# Altium schematic sheet Tranducer_Channel.SchDoc
size A
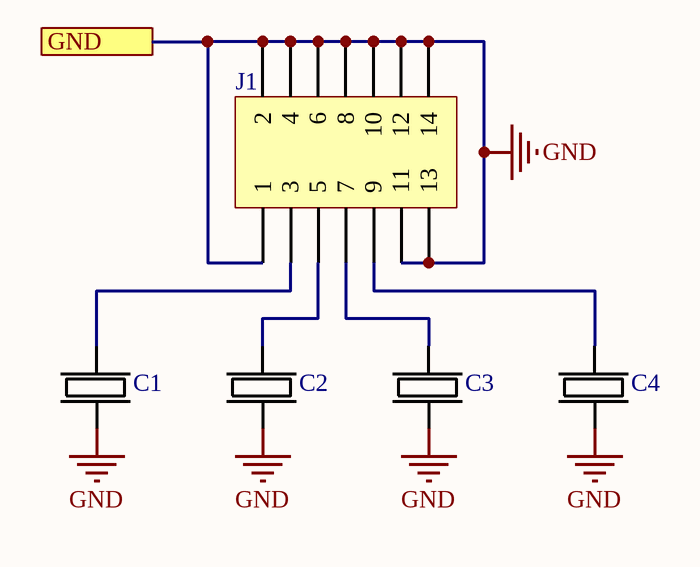
[diagram p0: Tranducer_Channel.SchDoc]

## Parts
C1  Transducer  [Transducer]  (value not drawn)
C2  Transducer  [Transducer]  (value not drawn)
C3  Transducer  [Transducer]  (value not drawn)
C4  Transducer  [Transducer]  (value not drawn)
J1  Header 7X2  [CONN_14x2_0.5IN]  (value not drawn)

## Ports
GND

## Nets
GND: C1.2 C2.2 C3.2 C4.2 J1.1 J1.2 J1.4 J1.6 J1.8 J1.10 J1.11 J1.12 J1.13 J1.14 ; port GND
NetC1_1: C1.1 J1.3
NetC2_1: C2.1 J1.5
NetC3_1: C3.1 J1.7
NetC4_1: C4.1 J1.9

## Library data of the parts
J1 = Header 7X2: Header, 7-Pin, Dual row; System: Connector; LatestRevisionDate: 17-Jul-2002; LatestRevisionNote: Re-released for DXP Platform.; Publisher: Altium Limited